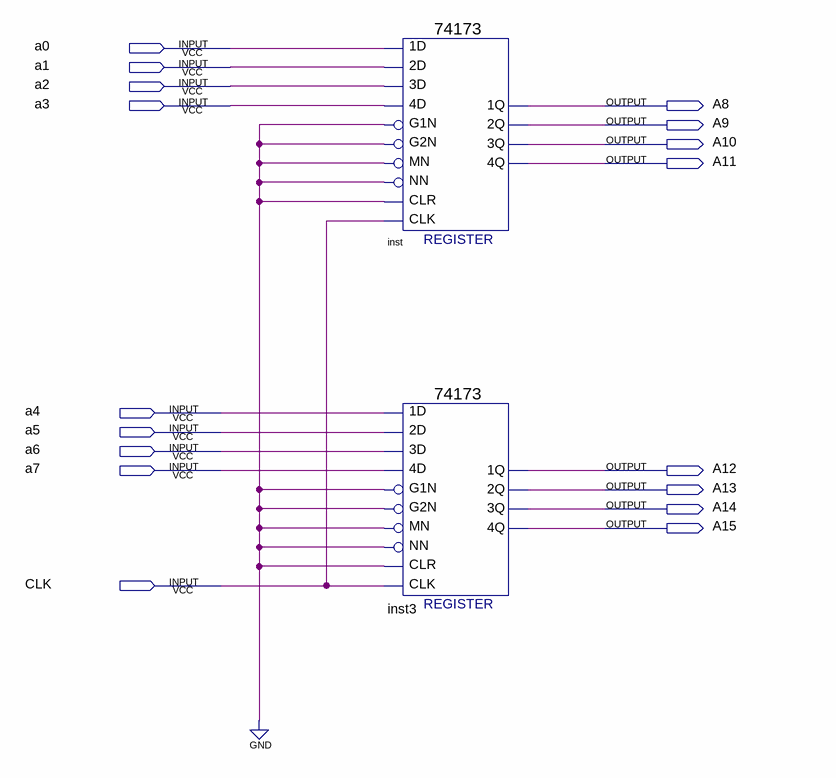
[diagram p0: schematic sheet]
// Quartus schematic 8-Reg.bdf as structural Verilog: 2 symbols, 17 pins
module \8-Reg  (
  input  a0,
  input  a1,
  input  a2,
  input  a3,
  input  a4,
  input  a5,
  input  a6,
  input  a7,
  input  CLK,
  output A8,
  output A9,
  output A10,
  output A11,
  output A12,
  output A13,
  output A14,
  output A15
);

  \74173  inst (
    .\3D (a2), .MN(1'b0), .\1D (a0), .\2D (a1), .\4D (a3), .G1N(1'b0), .G2N(1'b0), .NN(1'b0), .CLR(1'b0),
    .CLK(CLK), .\3Q (A10), .\2Q (A9), .\1Q (A8), .\4Q (A11));
  \74173  inst3 (
    .\3D (a6), .MN(1'b0), .\1D (a4), .\2D (a5), .\4D (a7), .G1N(1'b0), .G2N(1'b0), .NN(1'b0), .CLR(1'b0),
    .CLK(CLK), .\3Q (A14), .\2Q (A13), .\1Q (A12), .\4Q (A15));
endmodule
